# Altium project WLE5_WB.PrjPcb
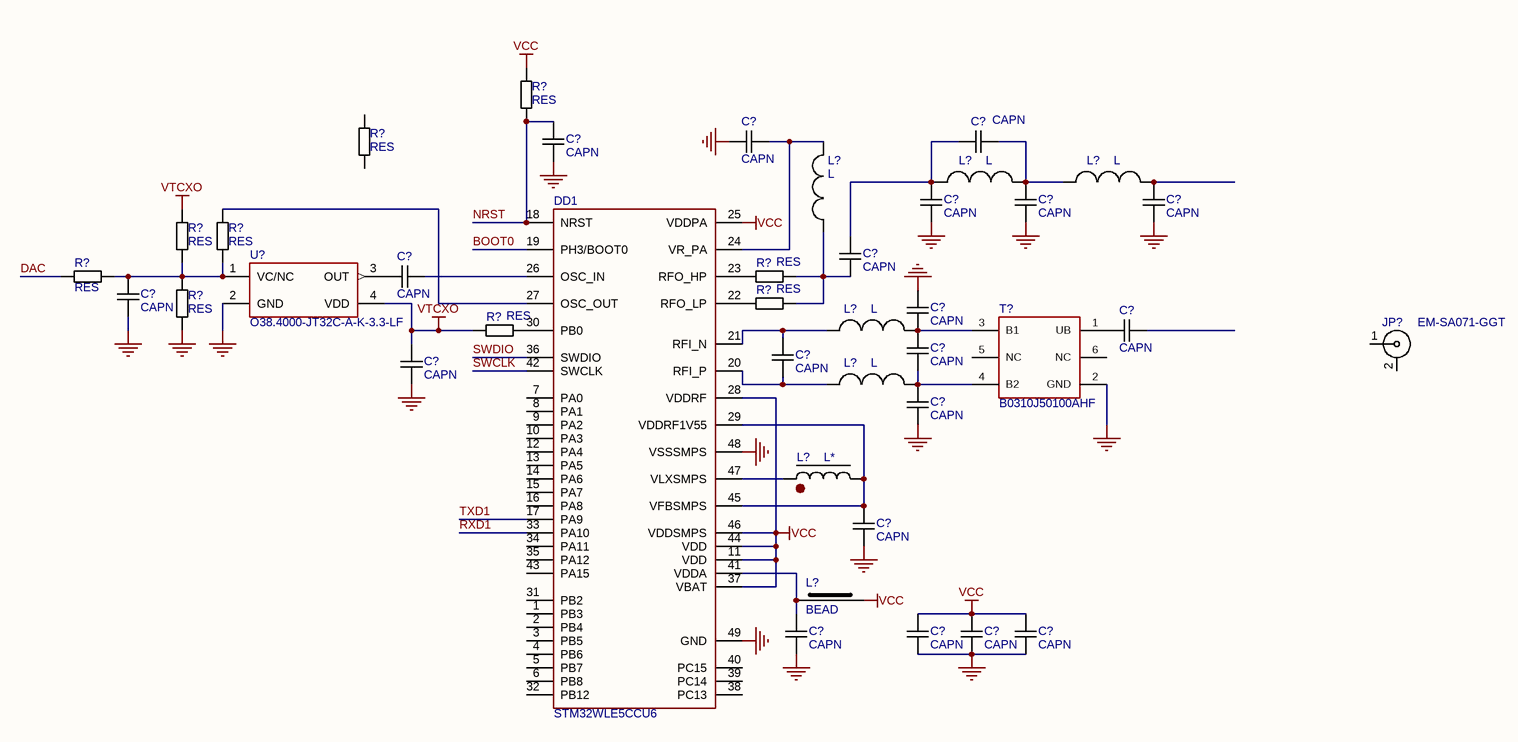
[diagram p0: WLE5_WB.SchDoc]
1 sheet, 40 parts. Net scope: global (net labels, ports and power ports of the same name join across sheets).
Board file: WLE5_WB.PcbDoc

## Sheet WLE5_WB.SchDoc
size 558 x 431 mm; SheetNumber: 1; SheetTotal: 1; DocumentName: Sheet1.SCHDOC

### Parts
(Parts that share a designator on the sheet are numbered #1, #2 ... from top to bottom, then left to right.)
C?#1  CAPN  [C-0402]
C?#2  CAPN  [C-0402]
C?#3  CAPN  [C-0402]
C?#4  CAPN  [C-0402]
C?#5  CAPN  [C-0402]
C?#6  CAPN  [C-0402]
C?#7  CAPN  [C-0402]
C?#8  CAPN  [C-0402]
C?#9  CAPN  [C-0402]
C?#10  CAPN  [C-0402]
C?#11  CAPN  [C-0402]
C?#12  CAPN  [C-0402]
C?#13  CAPN  [C-0402]
C?#14  CAPN  [C-0402]
C?#15  CAPN  [C-0402]
C?#16  CAPN  [C-0402]
C?#17  CAPN  [C-0402]
C?#18  CAPN  [C-0402]
C?#19  CAPN  [C-0402]
C?#20  CAPN  [C-0402]
DD1  STM32WLE5CCU6  [QFN48(7X7)]
JP?  EM-SA071-GGT  [SMA_F_EDGE]
L?#1  L  [L-0603]
L?#2  L  [L-0603]
L?#3  L  [L-0603]
L?#4  L  [L-0603]
L?#5  L  [L-0603]
L?#6  L*  [CDRH6D38]
L?#7  BEAD  [L-0402]
R?#1  RES  [R-0402]
R?#2  RES  [R-0402]
R?#3  RES  [R-0402]
R?#4  RES  [R-0402]
R?#5  RES  [R-0402]
R?#6  RES  [R-0402]
R?#7  RES  [R-0402]
R?#8  RES  [R-0402]
R?#9  RES  [R-0402]
T?  B0310J50100AHF  [BAL_TTM]
U?  O38.4000-JT32C-A-K-3.3-LF  [ZQ_3.2_2.5]

### Nets
GND: C?#1.2 C?#3.1 C?#4.1 C?#5.1 C?#6.1 C?#9.1 C?#10.2 C?#14.1 C?#15.1 C?#16.1 C?#17.1 C?#18.1 C?#19.1 C?#20.1 DD1.48(VSSSMPS) DD1.49(GND) R?#7.1 T?.2(GND) U?.2(GND)
VCC: C?#18.2 C?#19.2 C?#20.2 DD1.11(VDD) DD1.25(VDDPA) DD1.28(VDDRF) DD1.37(VBAT) DD1.44(VDD) DD1.46(VDDSMPS) L?#7.2 R?#1.1
VTCXO: C?#14.2 R?#3.2 R?#9.2 U?.4(VDD)
BOOT0: DD1.19(PH3/BOOT0)
DAC: R?#5.2
NRST: C?#3.2 DD1.18(NRST) R?#1.2
RXD1: DD1.33(PA10)
SWCLK: DD1.42(SWCLK)
SWDIO: DD1.36(SWDIO)
TXD1: DD1.17(PA9)
NetC?#1_1: C?#1.1 DD1.24(VR_PA) L?#3.2
NetC?#2_1: C?#2.1 C?#5.2 L?#1.2 L?#2.1
NetC?#2_2: C?#2.2 C?#4.2 C?#7.1 L?#1.1
NetC?#6_2: C?#6.2 L?#2.2
NetC?#7_2: C?#7.2 L?#3.1 R?#6.1 R?#8.1
NetC?#8_1: C?#8.1 U?.3(OUT)
NetC?#8_2: C?#8.2 DD1.26(OSC_IN)
NetC?#9_2: C?#9.2 R?#3.1 R?#4.1 R?#5.1 R?#7.2 U?.1(VC/NC)
NetC?#10_1: C?#10.1 C?#12.2 L?#4.2 T?.3(B1)
NetC?#11_2: C?#11.2 T?.1(UB)
NetC?#12_1: C?#12.1 C?#15.2 L?#5.2 T?.4(B2)
NetC?#13_1: C?#13.1 DD1.20(RFI_P) L?#5.1
NetC?#13_2: C?#13.2 DD1.21(RFI_N) L?#4.1
NetC?#16_2: C?#16.2 DD1.29(VDDRF1V55) DD1.45(VFBSMPS) L?#6.2
NetC?#17_2: C?#17.2 DD1.41(VDDA) L?#7.1
NetDD1_22: DD1.22(RFO_LP) R?#8.2
NetDD1_23: DD1.23(RFO_HP) R?#6.2
NetDD1_27: DD1.27(OSC_OUT) R?#4.2
NetDD1_30: DD1.30(PB0) R?#9.1
NetDD1_47: DD1.47(VLXSMPS) L?#6.1

Not connected (* = marked no-connect by the designer): C?#11 1; DD1 1(PB3) 2(PB4) 3(PB5) 4(PB6) 5(PB7) 6(PB8) 7(PA0) 8(PA1) 9(PA2) 10(PA3) 12(PA4) 13(PA5) 14(PA6) 15(PA7) 16(PA8) 31(PB2) 32(PB12) 34(PA11) 35(PA12) 38(PC13) 39(PC14) 40(PC15) 43(PA15); JP? 1 2; R?#2 1 2; T? 5(NC) 6(NC)

### Notes on the sheet
- DWG. NO.
- REV.
- SHT.
- REVISION
- DESCRIPTION
- DATE
- APPROVED
- THIS DOCUMENT AND THE DATA DISCLOSED HEREIN OR HEREWITH IS THE PROPERTY OF ALTIUM LIMITED AND MAY BE FREELY DISTRIBUTED IN WHOLE. NO RIGHTS ARE RESERVED OR EXPRESS OR IMPLIED WARANTEE GIVEN.
- ENG:
- DSN:
- APPROVALS
- PROJECT
- DOCUMENT REVISION:
- DESIGN ITEM:
- CHK:
- BOM:
- REFERENCE DOCUMENTS
- PROJECT REVISION:
- TITLE
- FAB DWG:
- PCB DWG:
- ASSY DWG:
- SCALE:
- SIZE
- C
- CAGE CODE
- FILE NAME
- DWG NO.
- SHEET
- OF
- REV

### Library data of the parts
C?#1-C?#20 = CAPN: Voltage: 50V; Точність/група: NP0; Вид: Конденсатор
DD1 = STM32WLE5CCU6: Value: {Value}; Mounting  Method: SMD
JP? = SMA: SMA Female R/A PCB Mount; Вид: Роз'єм
L?#1-L?#5 = L: Вид: Індуктивність
L?#6 = L*: Вид: Індуктивність
L?#7 = BEAD: Вид: Ferrite bead
R?#1-R?#9 = RES: Точність/група: 5%; Вид: Резистор
T? = B0310J50100AHF: Value: HMC8073LP3DE; Вид: Мікросхема
U? = TCXO_3225: Вид: Мікросхема; Value: O38.4000-JT32C-A-K-3.3-LF